# Altium schematic sheet BV100011_MCU144.SchDoc: MCU
size A3; DocumentNumber: MB1137; Revision: B-01; SheetNumber: 2; SheetTotal: 6; Project: NUCLEO-XXXXZX
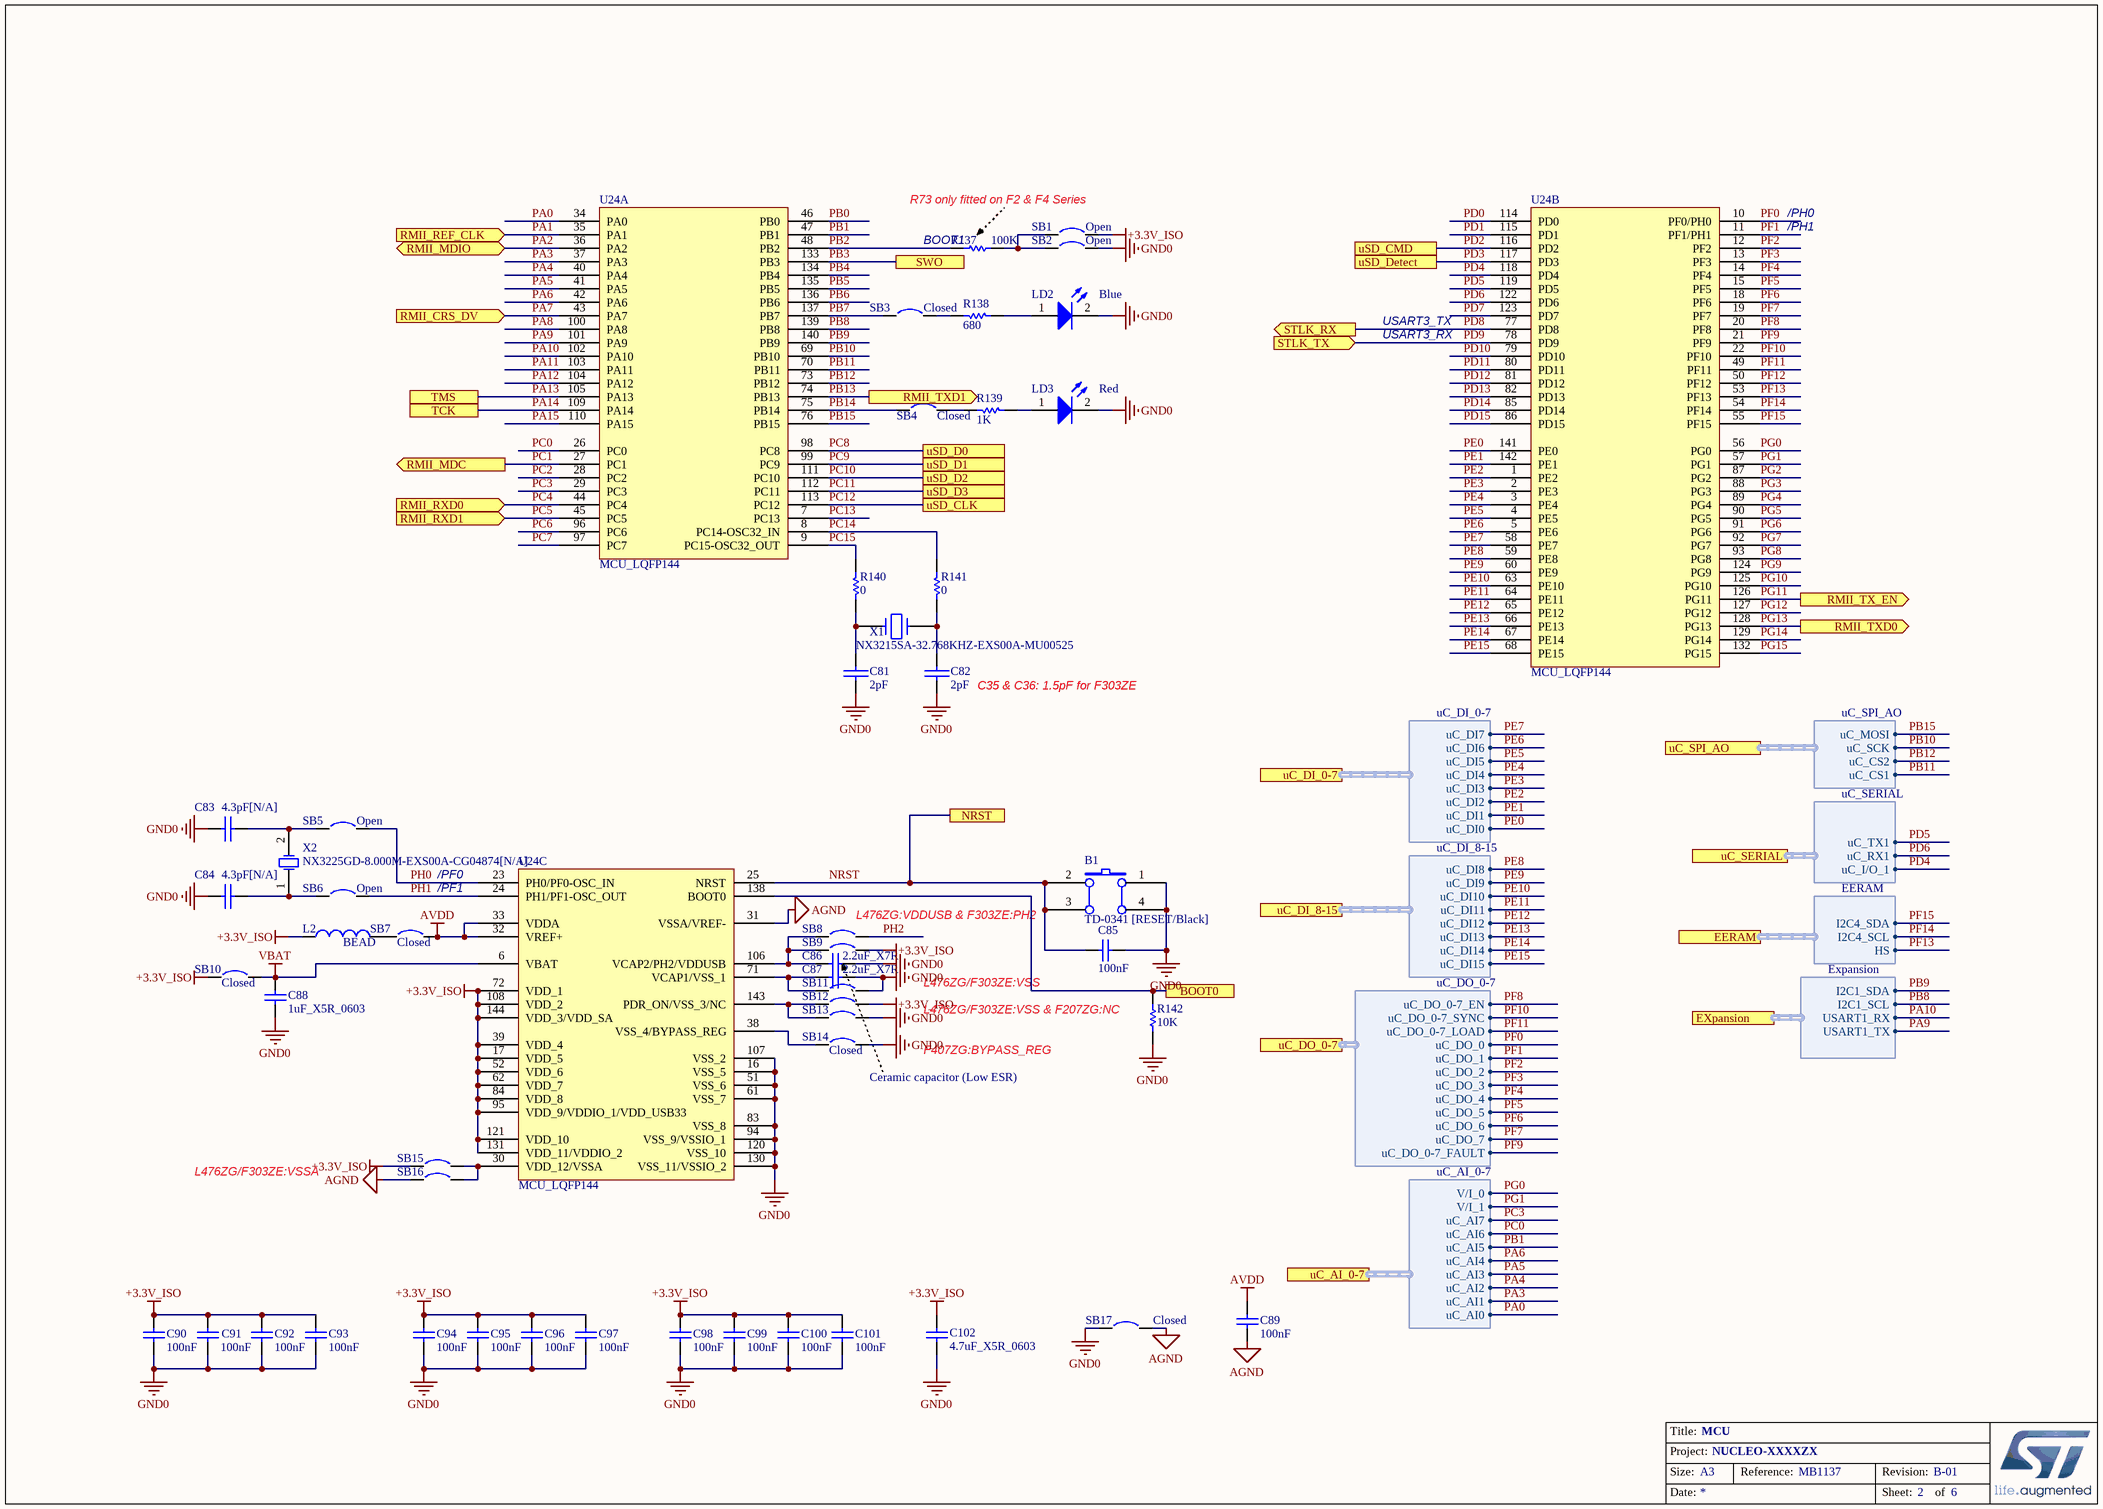
[diagram p0: BV100011_MCU144.SchDoc]

## Parts
B1  TD-0341 [RESET/Black]  [PB-6X6mm-Black]
C81  2pF  [0603C]
C82  2pF  [0603C]
C83  4.3pF[N/A]  [0603C]
C84  4.3pF[N/A]  [0603C]
C85  100nF  [0603C]
C86  2.2uF_X7R  [TAN-A]
C87  2.2uF_X7R  [TAN-A]
C88  1uF_X5R_0603  [0603C]
C89  100nF  [0603C]
C90  100nF  [0603C]
C91  100nF  [0603C]
C92  100nF  [0603C]
C93  100nF  [0603C]
C94  100nF  [0603C]
C95  100nF  [0603C]
C96  100nF  [0603C]
C97  100nF  [0603C]
C98  100nF  [0603C]
C99  100nF  [0603C]
C100  100nF  [0603C]
C101  100nF  [0603C]
C102  4.7uF_X5R_0603  [0603C]
L2  BEAD  [0603L]
LD2  Blue  [0603D-B]
LD3  Red  [0603D-R]
R137  100K  [0603R]
R138  680  [0603R]
R139  1K  [0603R]
R140  0  [0603R]
R141  0  [0603R]
R142  10K  [0603R]
SB1  Open  [SB_0603]
SB2  Open  [SB_0603]
SB3  Closed  [SB_0603]
SB4  Closed  [SB_0603]
SB5  Open  [SB_0603]
SB6  Open  [SB_0603]
SB7  Closed  [SB_0603]
SB8  Circuit Breaker  [SB_0603]  (value not drawn)
SB9  Circuit Breaker  [SB_0603]  (value not drawn)
SB10  Closed  [SB_0603]
SB11  Circuit Breaker  [SB_0603]  (value not drawn)
SB12  Circuit Breaker  [SB_0603]  (value not drawn)
SB13  Circuit Breaker  [SB_0603]  (value not drawn)
SB14  Closed  [SB_0603]
SB15  Circuit Breaker  [SB_0603]  (value not drawn)
SB16  Circuit Breaker  [SB_0603]  (value not drawn)
SB17  Closed  [SB_0603]
U24  MCU_LQFP144  [LQFP144_0R5_SKT]  (parts A,B,C of 3)
X1  NX3215SA-32.768KHZ-EXS00A-MU00525  [XTAL_2SM_3R2X1R5]
X2  NX3225GD-8.000M-EXS00A-CG04874[N/A]  [OSC_2SM_3R2x2R5]

## Ports
BOOT0, EERAM (harness EERAM), EXpansion (harness Expansion), NRST, RMII_CRS_DV (in), RMII_MDC (out), RMII_MDIO (bidir), RMII_REF_CLK (in), RMII_RXD0 (in), RMII_RXD1 (in), RMII_TX_EN (out), RMII_TXD0 (out), RMII_TXD1 (out), STLK_RX (out), STLK_TX (in), SWO, TCK, TMS, uC_AI_0-7 (harness uC_AI_0-7), uC_DI_0-7 (harness uC_DI_0-7), uC_DI_8-15 (harness uC_DI_8-15), uC_DO_0-7 (harness uC_DO_0-7), uC_SERIAL (harness uC_SERIAL), uC_SPI_AO (harness uC_SPI_AO), uSD_CLK, uSD_CMD, uSD_D0, uSD_D1, uSD_D2, uSD_D3, uSD_Detect

## Harnesses
uC_DI_0-7: uC_DI7, uC_DI6, uC_DI5, uC_DI4, uC_DI3, uC_DI2, uC_DI1, uC_DI0
uC_DI_8-15: uC_DI8, uC_DI9, uC_DI10, uC_DI11, uC_DI12, uC_DI13, uC_DI14, uC_DI15
uC_DO_0-7: uC_DO_0-7_EN, uC_DO_0-7_SYNC, uC_DO_0-7_LOAD, uC_DO_0, uC_DO_1, uC_DO_2, uC_DO_3, uC_DO_4, uC_DO_5, uC_DO_6, uC_DO_7, uC_DO_0-7_FAULT
uC_SPI_AO: uC_CS1, uC_CS2, uC_SCK, uC_MOSI
uC_SERIAL: uC_TX1, uC_RX1, uC_I/O_1
uC_AI_0-7: uC_AI0, uC_AI1, uC_AI2, uC_AI3, uC_AI4, uC_AI5, uC_AI6, uC_AI7, V/I_0, V/I_1
EERAM: HS, I2C4_SCL, I2C4_SDA
Expansion: I2C1_SDA, I2C1_SCL, USART1_RX, USART1_TX

## Nets
+3.3V_ISO: C90.1 C91.1 C92.1 C93.1 C94.1 C95.1 C96.1 C97.1 C98.1 C99.1 C100.1 C101.1 C102.1 L2.1 SB1.2 SB9.2 SB10.1 SB12.2 SB15.1 U24.17(VDD_5) U24.39(VDD_4) U24.52(VDD_6) U24.62(VDD_7) U24.72(VDD_1) U24.84(VDD_8) U24.95(VDD_9/VDDIO_1/VDD_USB33) U24.108(VDD_2) U24.121(VDD_10) U24.131(VDD_11/VDDIO_2) U24.144(VDD_3/VDD_SA)
AGND: C89.2 SB16.1 SB17.2 U24.31(VSSA/VREF-)
AVDD: C89.1 SB7.2 U24.32(VREF+) U24.33(VDDA)
GND0: B1.1(A0) B1.4(A1) C81.2 C82.2 C83.2 C84.2 C85.1 C86.2 C87.2 C88.2 C90.2 C91.2 C92.2 C93.2 C94.2 C95.2 C96.2 C97.2 C98.2 C99.2 C100.2 C101.2 C102.2 LD2.2(K) LD3.2(K) R142.2 SB2.2 SB11.2 SB13.2 SB14.2 SB17.1 U24.16(VSS_5) U24.51(VSS_6) U24.61(VSS_7) U24.83(VSS_8) U24.94(VSS_9/VSSIO_1) U24.107(VSS_2) U24.120(VSS_10) U24.130(VSS_11/VSSIO_2)
VBAT: C88.1 SB10.2 U24.6(VBAT)
BOOT0: R142.1 U24.138(BOOT0) ; port BOOT0
NRST: B1.2(B0) B1.3(B1) C85.2 U24.25(NRST) ; port NRST
PA0: U24.34(PA0) ; port uC_AI_0-7.uC_AI0
PA1: U24.35(PA1) ; port RMII_REF_CLK
PA2: U24.36(PA2) ; port RMII_MDIO
PA3: U24.37(PA3) ; port uC_AI_0-7.uC_AI1
PA4: U24.40(PA4) ; port uC_AI_0-7.uC_AI2
PA5: U24.41(PA5) ; port uC_AI_0-7.uC_AI3
PA6: U24.42(PA6) ; port uC_AI_0-7.uC_AI4
PA7: U24.43(PA7) ; port RMII_CRS_DV
PA8: U24.100(PA8)
PA9: U24.101(PA9) ; port EXpansion.USART1_TX
PA10: U24.102(PA10) ; port EXpansion.USART1_RX
PA11: U24.103(PA11)
PA12: U24.104(PA12)
PA13: U24.105(PA13) ; port TMS
PA14: U24.109(PA14) ; port TCK
PA15: U24.110(PA15)
PB0: U24.46(PB0)
PB1: U24.47(PB1) ; port uC_AI_0-7.uC_AI5
PB2: R137.1 U24.48(PB2)
PB3: U24.133(PB3) ; port SWO
PB4: U24.134(PB4)
PB5: U24.135(PB5)
PB6: U24.136(PB6)
PB7: SB3.1 U24.137(PB7)
PB8: U24.139(PB8) ; port EXpansion.I2C1_SCL
PB9: U24.140(PB9) ; port EXpansion.I2C1_SDA
PB10: U24.69(PB10) ; port uC_SPI_AO.uC_SCK
PB11: U24.70(PB11) ; port uC_SPI_AO.uC_CS1
PB12: U24.73(PB12) ; port uC_SPI_AO.uC_CS2
PB13: U24.74(PB13) ; port RMII_TXD1
PB14: SB4.1 U24.75(PB14)
PB15: U24.76(PB15) ; port uC_SPI_AO.uC_MOSI
PC0: U24.26(PC0) ; port uC_AI_0-7.uC_AI6
PC1: U24.27(PC1) ; port RMII_MDC
PC2: U24.28(PC2)
PC3: U24.29(PC3) ; port uC_AI_0-7.uC_AI7
PC4: U24.44(PC4) ; port RMII_RXD0
PC5: U24.45(PC5) ; port RMII_RXD1
PC6: U24.96(PC6)
PC7: U24.97(PC7)
PC8: U24.98(PC8) ; port uSD_D0
PC9: U24.99(PC9) ; port uSD_D1
PC10: U24.111(PC10) ; port uSD_D2
PC11: U24.112(PC11) ; port uSD_D3
PC12: U24.113(PC12) ; port uSD_CLK
PC13: U24.7(PC13)
PC14: R141.2 U24.8(PC14-OSC32_IN)
PC15: R140.2 U24.9(PC15-OSC32_OUT)
PD0: U24.114(PD0)
PD1: U24.115(PD1)
PD2: U24.116(PD2) ; port uSD_CMD
PD3: U24.117(PD3) ; port uSD_Detect
PD4: U24.118(PD4) ; port uC_SERIAL.uC_I/O_1
PD5: U24.119(PD5) ; port uC_SERIAL.uC_TX1
PD6: U24.122(PD6) ; port uC_SERIAL.uC_RX1
PD7: U24.123(PD7)
PD8: U24.77(PD8) ; port STLK_RX
PD9: U24.78(PD9) ; port STLK_TX
PD10: U24.79(PD10)
PD11: U24.80(PD11)
PD12: U24.81(PD12)
PD13: U24.82(PD13)
PD14: U24.85(PD14)
PD15: U24.86(PD15)
PE0: U24.141(PE0) ; port uC_DI_0-7.uC_DI0
PE1: U24.142(PE1) ; port uC_DI_0-7.uC_DI1
PE2: U24.1(PE2) ; port uC_DI_0-7.uC_DI2
PE3: U24.2(PE3) ; port uC_DI_0-7.uC_DI3
PE4: U24.3(PE4) ; port uC_DI_0-7.uC_DI4
PE5: U24.4(PE5) ; port uC_DI_0-7.uC_DI5
PE6: U24.5(PE6) ; port uC_DI_0-7.uC_DI6
PE7: U24.58(PE7) ; port uC_DI_0-7.uC_DI7
PE8: U24.59(PE8) ; port uC_DI_8-15.uC_DI8
PE9: U24.60(PE9) ; port uC_DI_8-15.uC_DI9
PE10: U24.63(PE10) ; port uC_DI_8-15.uC_DI10
PE11: U24.64(PE11) ; port uC_DI_8-15.uC_DI11
PE12: U24.65(PE12) ; port uC_DI_8-15.uC_DI12
PE13: U24.66(PE13) ; port uC_DI_8-15.uC_DI13
PE14: U24.67(PE14) ; port uC_DI_8-15.uC_DI14
PE15: U24.68(PE15) ; port uC_DI_8-15.uC_DI15
PF0: U24.10(PF0/PH0) ; port uC_DO_0-7.uC_DO_0
PF1: U24.11(PF1/PH1) ; port uC_DO_0-7.uC_DO_1
PF2: U24.12(PF2) ; port uC_DO_0-7.uC_DO_2
PF3: U24.13(PF3) ; port uC_DO_0-7.uC_DO_3
PF4: U24.14(PF4) ; port uC_DO_0-7.uC_DO_4
PF5: U24.15(PF5) ; port uC_DO_0-7.uC_DO_5
PF6: U24.18(PF6) ; port uC_DO_0-7.uC_DO_6
PF7: U24.19(PF7) ; port uC_DO_0-7.uC_DO_7
PF8: U24.20(PF8) ; port uC_DO_0-7.uC_DO_0-7_EN
PF9: U24.21(PF9) ; port uC_DO_0-7.uC_DO_0-7_FAULT
PF10: U24.22(PF10) ; port uC_DO_0-7.uC_DO_0-7_SYNC
PF11: U24.49(PF11) ; port uC_DO_0-7.uC_DO_0-7_LOAD
PF12: U24.50(PF12)
PF13: U24.53(PF13) ; port EERAM.HS
PF14: U24.54(PF14) ; port EERAM.I2C4_SCL
PF15: U24.55(PF15) ; port EERAM.I2C4_SDA
PG0: U24.56(PG0) ; port uC_AI_0-7.V/I_0
PG1: U24.57(PG1) ; port uC_AI_0-7.V/I_1
PG2: U24.87(PG2)
PG3: U24.88(PG3)
PG4: U24.89(PG4)
PG5: U24.90(PG5)
PG6: U24.91(PG6)
PG7: U24.92(PG7)
PG8: U24.93(PG8)
PG9: U24.124(PG9)
PG10: U24.125(PG10)
PG11: U24.126(PG11) ; port RMII_TX_EN
PG12: U24.127(PG12)
PG13: U24.128(PG13) ; port RMII_TXD0
PG14: U24.129(PG14)
PG15: U24.132(PG15)
PH0: SB5.2 U24.23(PH0/PF0-OSC_IN)
PH1: SB6.2 U24.24(PH1/PF1-OSC_OUT)
PH2: SB8.2
NetC81_1: C81.1 R140.1 X1.1
NetC82_1: C82.1 R141.1 X1.2
NetC83_1: C83.1 SB5.1 X2.2(OSC2)
NetC84_1: C84.1 SB6.1 X2.1(OSC1)
NetC86_1: C86.1 SB8.1 SB9.1 U24.106(VCAP2/PH2/VDDUSB)
NetC87_1: C87.1 SB11.1 U24.71(VCAP1/VSS_1)
NetL2_2: L2.2 SB7.1
NetLD2_1: LD2.1(A) R138.2
NetLD3_1: LD3.1(A) R139.2
NetR137_2: R137.2 SB1.1 SB2.1
NetR138_1: R138.1 SB3.2
NetR139_1: R139.1 SB4.2
NetSB12_1: SB12.1 SB13.1 U24.143(PDR_ON/VSS_3/NC)
NetSB14_1: SB14.1 U24.38(VSS_4/BYPASS_REG)
NetSB15_2: SB15.2 SB16.2 U24.30(VDD_12/VSSA)

## Notes on the sheet
- R73 only fitted on F2 & F4 Series
- (near R137) BOOT1
- /PH0
- /PH1
- USART3_TX
- USART3_RX
- (near C82) C35 & C36: 1.5pF for F303ZE
- /PF0
- /PF1
- (near SB8) L476ZG:VDDUSB & F303ZE:PH2
- L476ZG/F303ZE:VSS
- L476ZG/F303ZE:VSS & F207ZG:NC
- F407ZG:BYPASS_REG
- (near SB14) Ceramic capacitor (Low ESR)
- L476ZG/F303ZE:VSSA
- Title:
- Project:
- Size:
- Date:
- A3
- Reference:
- Sheet:
- Revision:
- of

## Library data of the parts
B1 = SW PUSHBUTTON: SE PUSHBUTTON
C81-C84 = CAP: Capacitor
C85 = CAP: Capacitor; Value: 100pF; Published: 8-Jun-2000; Revision: July-2002: Re-released for DXP Platform.; Publisher: Altium Limited
C86 C87 = Cap_2.2uF_X7R_10%_0805: Capacitor,2.2uF,16V, X7R,10%,0805,YAGEO; Manuf_Part_1: CC0805KKX7R7BB225; Revision: July-2002: Re-released for DXP Platform.; Value: 2.2uF; Order: CC0805KKX7R7BB225; Manuf_1: YAGEO
C88 = CAP SMD 0603  X5R 1µF 25V 10%: 0603  X5R 1µF; Rated voltage: 25V; Tolerance: 10%; Manufacturer: *; Manufacturer P/N: *; Order code Farnell: 1288202RL; Value: 1µF; Power: *; Technology: X5R; Temperature  Factor: *; Temperature Max: +125°C; Temperature Min: -55°C; STS Code: *
C89-C101 = Cap: Capacitor; Value: 10nF; Published: 8-Jun-2000; Revision: July-2002: Re-released for DXP Platform.; Publisher: Altium Limited
C102 = CAP SMD 0603  X5R 1µF 25V 10%: 0603  X5R 4.7uF; Value: 1µF; Rated voltage: 25V; Tolerance: 10%; Manufacturer: *; Manufacturer P/N: *; Order code Farnell: 1288202RL; Power: *; Technology: X5R; Temperature  Factor: *; Temperature Max: +125°C; Temperature Min: -55°C; STS Code: *
L2 = Inductor: Value: 100uH; Published: 8-Jun-2000; Revision: July-2002: Re-released for DXP Platform.; Publisher: Altium Limited
LD2 LD3 = LED2: Typical RED, GREEN, YELLOW, AMBER GaAs LED; Published: 8-Jun-2000; Revision: July-2002: Re-released for DXP Platform.; Publisher: Altium Limited
R137 R142 = res1: Resistor; Value: 1K; Published: 8-Jun-2000; Revision: July-2002: Re-released for DXP Platform.; Publisher: Altium Limited
R138 R140 R141 = Res1: Resistor; Value: 1K; Published: 8-Jun-2000; Revision: July-2002: Re-released for DXP Platform.; Publisher: Altium Limited
R139 = Res1: Resistor; Published: 8-Jun-2000; Revision: July-2002: Re-released for DXP Platform.; Publisher: Altium Limited; Value: 1K
SB1 SB2 SB5 SB6 = Circuit Breaker: Published: 24-Mar-1999; Revision: July-2002: Re-released for DXP Platform.; Publisher: Altium Limited
SB3 SB4 SB7 SB10 SB14 SB17 = Circuit Breaker_close: Circuit Breaker; Published: 24-Mar-1999; Revision: July-2002: Re-released for DXP Platform.; Publisher: Altium Limited
SB8 SB9 SB11-SB13 SB15 SB16 = Circuit Breaker: Solder: NO; Published: 24-Mar-1999; Revision: July-2002: Re-released for DXP Platform.; Publisher: Altium Limited
X1 = CRYSTAL_32K: Crystal
X2 = XTAL: Crystal Oscillator; Published: 8-Jun-2000; LatestRevisionDate: 17-Jul-2002; LatestRevisionNote: Re-released for DXP Platform.; PackageReference: R38; Publisher: Altium Limited